# Altium schematic sheet schematic.SchDoc
size A4; SheetNumber: 1; SheetTotal: 1
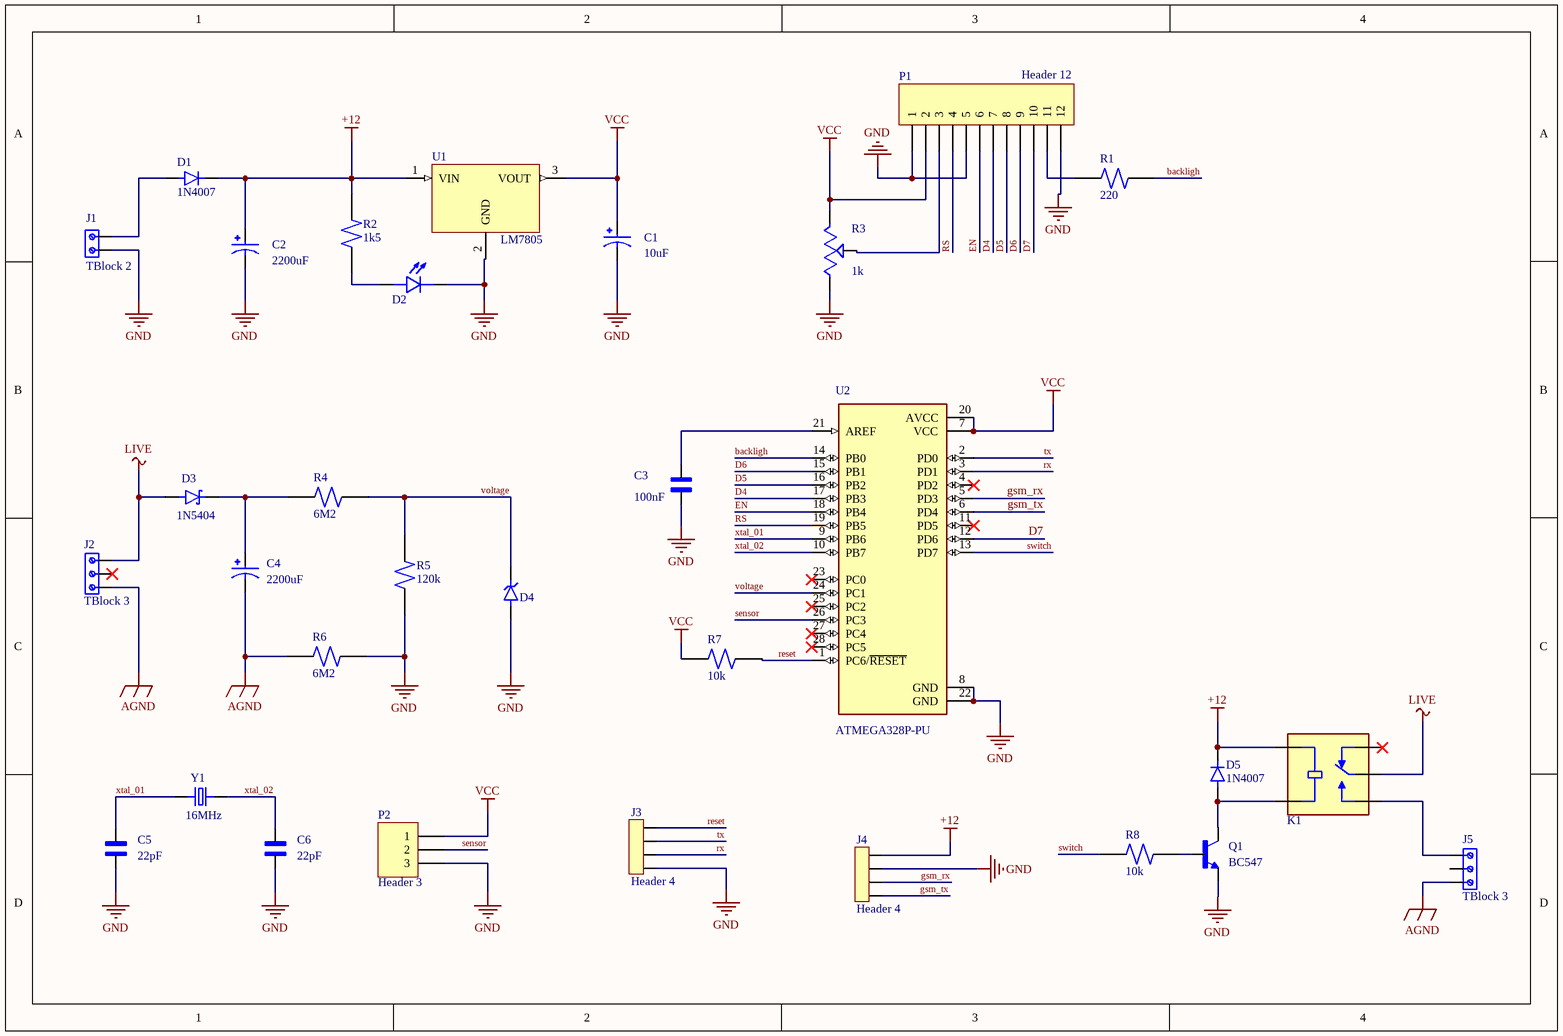
[diagram p0: schematic.SchDoc]

## Parts
C1  10uF  [CAPPRD500W50D500H1100]
C2  2200uF  [CAPPRD500W50D500H1100]
C3  100nF  [CAPRB500W50L450T300H550]
C4  2200uF  [CAPPRD750W80D1600H2500]
C5  22pF  [CAPRB500W50L450T300H550]
C6  22pF  [CAPRB500W50L450T300H550]
D1  1N4007  [DIOAD1060W80L520D270]
D2  L08R5000Q1  [LEDRD254W57D500H1070]  (value not drawn)
D3  1N5404  [DIOAD1990W125L900D530]
D4  1N4745A  [DIOAD1060W70L435D230]  (value not drawn)
D5  1N4007  [DIOAD1060W80L520D270]
J1  TBlock 2  [691111710002]
J2  TBlock 3  [691214110003]
J3  Header 4  [SULLINS_PPTC041LFBN-RC]
J4  Header 4  [SULLINS_PPTC041LFBN-RC]
J5  TBlock 3  [691214110003]
K1  JQC-3F-1C-24VDC  [RELAY_JQC-3F-1C-24VDC]  (value not drawn)
P1  Header 12  [HDR1X12]
P2  Header 3  [HDR1X3]
Q1  BC547  [TO92250P510H770-3]
R1  220  [RESAD1100W55L680D260]
R2  1k5  [RESAD1100W55L680D260]
R3  1k  [TRIM_3306F-1-105]
R4  6M2  [RESAD1100W55L680D260]
R5  120k  [RESAD1100W55L680D260]
R6  6M2  [RESAD1100W55L680D260]
R7  10k  [RESAD1100W55L680D260]
R8  10k  [RESAD1100W55L680D260]
U1  LM7805  [TO255P1020X450X1968-3]
U2  ATMEGA328P-PU  [DIP794W46P254L2967H457Q28B]
Y1  16MHz  [XTAL_ECS-160-20-4X]

## Nets
+12: C2.P D1.C D5.C J4.1 K1.COIL1 R2.2 U1.1(VIN)
AGND: C4.N J2.1 J5.3 R6.2
GND: C1.N C2.N C3.1 C5.1 C6.1 D2.C D4.A J1.1 J3.4 J4.2 P1.1 P1.5 P1.12 P2.3 Q1.3(E) R3.1(CCW) R5.1 R6.1 U1.2(GND) U2.8(GND) U2.22(GND)
LIVE: D3.A J2.3 K1.COM
VCC: C1.P P1.2 P2.1 R3.3(CW) R7.2 U1.3(VOUT) U2.7(VCC) U2.20(AVCC)
backligh: R1.1 U2.14(PB0)
D4: P1.7 U2.17(PB3)
D5: P1.8 U2.16(PB2)
D6: P1.9 U2.15(PB1)
D7: P1.10 U2.12(PD6)
EN: P1.6 U2.18(PB4)
gsm_rx: J4.3 U2.5(PD3)
gsm_tx: J4.4 U2.6(PD4)
reset: J3.1 R7.1 U2.1(PC6/~{RESET})
RS: P1.4 U2.19(PB5)
rx: J3.3 U2.3(PD1)
sensor: P2.2 U2.26(PC3)
switch: R8.2 U2.13(PD7)
tx: J3.2 U2.2(PD0)
voltage: D4.C(K) R4.1 R5.2 U2.24(PC1)
xtal_01: C5.2 U2.9(PB6) Y1.1
xtal_02: C6.2 U2.10(PB7) Y1.2
NetC3_2: C3.2 U2.21(AREF)
NetC4_P: C4.P D3.C(K) R4.2
NetD1_A: D1.A J1.2
NetD2_A: D2.A R2.1
NetD5_A: D5.A K1.COIL2 Q1.1(C)
NetJ5_1: J5.1 K1.NO
NetP1_3: P1.3 R3.2(WIPER)
NetP1_11: P1.11 R1.2
NetQ1_2: Q1.2(B) R8.1

Not connected (* = marked no-connect by the designer): J2 2*; J5 2; K1 NC*; U2 4(PD2)* 11(PD5)* 23(PC0)* 25(PC2)* 27(PC4)* 28(PC5)*

## Library data of the parts
C1 C2 = Electrolytic capacitor: FS-A; MF: {'manufacturer': u'Panasonic'}; MP: EEUFS0J221B; Package: None; Value: *; Availability: Unavailable; Price: None
C3 C5 C6 = Ceramic capacitor: 2200 pF Â±10% 250V Ceramic Capacitor X7R Radial; MF: TDK; MP: FG24X7R2E222KNT06; Digi-Key_Part_Number: 445-173386-1-ND; Purchase-URL: https://pricing.snapeda.com/search/part/FG24X7R2E222KNT06/?ref=eda; Check_prices: https://www.snapeda.com/parts/FG24X7R2E222KNT06/TDK/view-part/?ref=eda; Value: *; Package: Radial TDK; SnapEDA_Link: https://www.snapeda.com/parts/FG24X7R2E222KNT06/TDK/view-part/?ref=snap
C4 = Capacitor (16 x 25mm): Cap Aluminum 33uF 400V 20% (16 X 25mm) Radial Aluminum Cylindrical Can 7.5mm 275mA 2000 hr 85Â°C Bulk; MF: Panasonic; MP: ECA2GM330; Value: *; Price: None; Package: RADIAL-2 Panasonic; Check_prices: https://www.snapeda.com/parts/ECA2GM330/Panasonic/view-part/5790262/?ref=eda; Availability: In Stock; SnapEDA_Link: https://www.snapeda.com/parts/ECA2GM330/Panasonic/view-part/5790262/?ref=snap; Purchase-URL: https://pricing.snapeda.com/search/part/ECA2GM330/?ref=eda
D1 D5 = 1N4007: Diode Switching 1KV 1A 2-Pin DO-41; Price: None; MP: 1N4007; Value: *; Availability: Unavailable; Package: None
D2 = LED: LED, Orange, Through Hole, T-1 3/4 (5mm), 30 mA, 2.1 V, 635 nm; MF: {'manufacturer': u'LED Technology'}; Price: None; Package: None; Availability: Unavailable; MP: L08R5000Q1; Value: *
D3 = Schrotic diode: Diode Standard 400 V 3A Through Hole DO-201AD; MF: ON Semiconductor; Purchase-URL: https://pricing.snapeda.com/search/part/1N5404/?ref=eda; Price: None; Check_prices: https://www.snapeda.com/parts/1N5404/Onsemi/view-part/?ref=eda; MP: 1N5404; Value: *; Package: AXIAL LEAD-2 ON Semiconductor; SnapEDA_Link: https://www.snapeda.com/parts/1N5404/Onsemi/view-part/?ref=snap; Availability: In Stock
D4 = Zenner diode: Zener Diode 16V 1W Â±5% Through Hole DO-204AL (DO-41); MF: ON Semiconductor; Purchase-URL: https://pricing.snapeda.com/search/part/1N4745A/?ref=eda; Check_prices: https://www.snapeda.com/parts/1N4745A/Onsemi/view-part/?ref=eda; Availability: In Stock; Value: *; MP: 1N4745A; Price: None; Package: DO-41-2 ON Semiconductor; SnapEDA_Link: https://www.snapeda.com/parts/1N4745A/Onsemi/view-part/?ref=snap
J1 = Terminal Block - 2Pins: 2 Position Wire to Board Terminal Block Horizontal with Board 0.197 _5.00mm_ Through Hole; MF: Wurth Electronics; Value: *; Availability: Unavailable; MP: 691111710002; Price: None; Package: None; SnapEDA_Link: https://www.snapeda.com/parts/691111710002/Wurth%20Electronics%20Inc./view-part/1195092/?ref=snap
J2 J5 = Terminal blocks - 3Pins (Small): 3 Position Wire to Board Terminal Block Horizontal with Board 0.138 (3.50mm) Through Hole; MF: Wurth Elektronik; Price: None; SnapEDA_Link: https://www.snapeda.com/parts/691214110003/Wurth+Elektronik/view-part/?ref=snap; Purchase-URL: https://pricing.snapeda.com/search/part/691214110003/?ref=eda; Availability: In Stock; MP: 691214110003; Package: None; Check_prices: https://www.snapeda.com/parts/691214110003/Wurth+Elektronik/view-part/?ref=eda; Value: *
J3 J4 = Female header - 4Pins: 4 Position Header Connector Through Hole; MP: PPTC041LFBN-RC; MF: Sullins Connector; Value: *; SnapEDA_Link: https://www.snapeda.com/parts/PPTC041LFBN-RC/Sullins%20Connector%20Solutions/view-part/285917/?ref=snap; Package: None; Availability: Warning; Check_prices: https://www.snapeda.com/parts/PPTC041LFBN-RC/Sullins%20Connector%20Solutions/view-part/285917/?ref=eda; Price: None; Purchase-URL: https://pricing.snapeda.com/search/part/PPTC041LFBN-RC/?ref=eda
K1 = Relay (Standard): Miniature PCB Relay 24VDC, 10A 250VAC, 15A 125VAC, 10A 250VAC; Package: None; MP: JQC-3F-1C-24VDC; Value: *; Price: None; Availability: Unavailable
P1 = Header 12: Header, 12-Pin; LatestRevisionDate: 17-Jul-2002; LatestRevisionNote: Re-released for DXP Platform.; Publisher: Altium Limited
P2 = Header 3: Header, 3-Pin; LatestRevisionDate: 17-Jul-2002; LatestRevisionNote: Re-released for DXP Platform.; Publisher: Altium Limited
Q1 = BC547B: <a href="https://pricing.snapeda.com/parts/BC337-16%20A1/Taiwan%20Semiconductor/view-part?ref=eda">Check availability</a> <a href="https://pricing.snapeda.com/parts/BC337-16%20A1/Taiwan%20Semiconductor/view-part?ref=eda">Check availability</a>; Price: None; Value: *; Package: None; Availability: Unavailable; MP: BC547B
R1 R2 R4-R8 = Resistor (0.25W): (MFR-25FBF52-10K) 10,2 kOhm bei 1% 0,25W, 1/4W Durchbohrlochwiderstand Axial Metal Film; MF: Yageo; Digi-Key_Part_Number: 10.2KXBK-ND; SnapEDA_Link: https://www.snapeda.com/parts/MFR-25FBF52-10K/Yageo/view-part/424333/?ref=snap; Package: Axial Yageo; Purchase-URL: https://pricing.snapeda.com/search/part/MFR-25FBF52-10K/?ref=eda; MP: MFR-25FBF52-10K; Value: *
R3 = Potentiometer1: (3306F-1-105) 1 MOhms 0.2W, 1/5W PC Pins Through Hole Trimmer Potentiometer Cermet 1 Turn Top Adjustment; MF: Bourns; Check_prices: https://www.snapeda.com/parts/3306F-1-105/Bourns%20-%20J.W.%20Miller/view-part/862876/?ref=eda; Availability: Good; Value: *; Price: None; MP: 3306F-1-105; SnapEDA_Link: https://www.snapeda.com/parts/3306F-1-105/Bourns%20-%20J.W.%20Miller/view-part/862876/?ref=snap; Package: 3306F Bourns; Purchase-URL: https://pricing.snapeda.com/search/part/3306F-1-105/?ref=eda
U1 = LM78__: MP: LM7805CT/NOPB; Price: None; Value: *; Availability: Unavailable; Package: None
U2 = ATMEGA328P-PU: ATmega Series 20 MHz 32 KB Flash 2 KB SRAM 8-Bit Microcontroller - DIP-28; Value: *; MP: ATMEGA328P-PU; Package: None; Availability: Unavailable; Price: None
Y1 = Crystal oscilator: CRYSTAL T/H; MF: {'manufacturer': u'ECS Inc.'}; MP: ECS-160-S-4; Package: None; Value: *; Availability: Unavailable; Price: None